# EAGLE design 2023_ROBOCON_B_CHIKU (EAGLE 9.6.2)

## Sheet 1 of 2
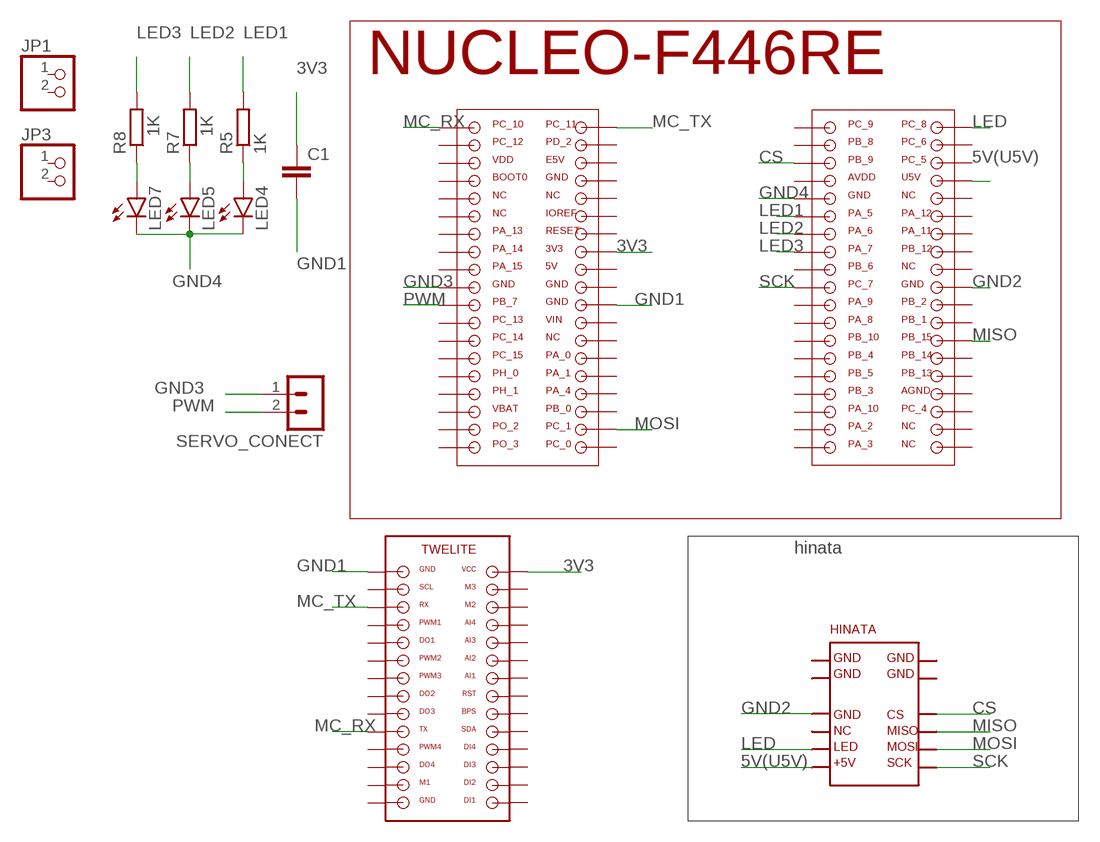
[diagram p0: schematic, sheet 1]

### Parts
C1  C2,5-3  [C2.5-3]
JP1  PINHD-1X2  [1X02]
JP3  PINHD-1X2  [1X02]
LED4  LED3MM  [LED3MM]
LED5  LED3MM  [LED3MM]
LED7  LED3MM  [LED3MM]
R5  1K  R-EU_0204/5  [0204/5]
R7  1K  R-EU_0204/5  [0204/5]
R8  1K  R-EU_0204/5  [0204/5]
SERVO_CONECT  02-JST  [B2B-XH]
U$2  F446RE  [F446RE]
U$5  TWELITE-PIN  [TWELITE-PIN]
U$6  HINATA  [HINATA]

### Nets
3V3: C1.1 U$2.3V3 U$5.VCC
5V(U5V): U$2.USV U$6.+5V
CS: U$2.PB_9 U$6.CS
GND1: C1.2 U$2.GND6 U$5.GND1
GND2: U$2.GND2 U$6.GND5
GND3: SERVO_CONECT.1 U$2.GND3
GND4: LED4.K(C) LED5.K(C) LED7.K(C) U$2.GND
LED: U$2.PC_8 U$6.LED
LED1: R5.2 U$2.PA_5
LED2: R7.2 U$2.PA_6
LED3: R8.2 U$2.PA_7
MC_RX: U$2.PC_10 U$5.TX
MC_TX: U$2.PC_11 U$5.RX
MISO: U$2.PB_15 U$6.MISO
MOSI: U$2.PC_1 U$6.MOSI
N$6: LED4.A R5.1
N$11: LED5.A R7.1
N$14: LED7.A R8.1
PWM: SERVO_CONECT.2 U$2.PB_7
SCK: U$2.PC_7 U$6.SCK
Unconnected: JP1.1 JP1.2 JP3.1 JP3.2 U$2.5V U$2.AGND U$2.AVDD U$2.BOOT0 U$2.ESV U$2.GND4 U$2.GND5 U$2.IOREF U$2.NC U$2.NC2 U$2.NC3 U$2.NC4 U$2.NC5 U$2.NC6 U$2.NC7 U$2.NC8 U$2.PA_0 U$2.PA_1 U$2.PA_2 U$2.PA_3 U$2.PA_4 U$2.PA_8 U$2.PA_9 U$2.PA_10 U$2.PA_11 U$2.PA_12 U$2.PA_13 U$2.PA_14 U$2.PA_15 U$2.PB_0 U$2.PB_1 U$2.PB_2 U$2.PB_3 U$2.PB_4 U$2.PB_5 U$2.PB_6 U$2.PB_8 U$2.PB_10 U$2.PB_12 U$2.PB_13 U$2.PB_14 U$2.PC_0 U$2.PC_2 U$2.PC_3 U$2.PC_4 U$2.PC_5 U$2.PC_6 U$2.PC_9 U$2.PC_12 U$2.PC_13 U$2.PC_14 U$2.PC_15 U$2.PD_2 U$2.PH_0 U$2.PH_1 U$2.RESET U$2.VBAT U$2.VDD U$2.VIN U$5.AI1 U$5.AI2 U$5.AI3 U$5.AI4 U$5.BPS U$5.DI1 U$5.DI2 U$5.DI3 U$5.DI4 U$5.DO1 U$5.DO2 U$5.DO3 U$5.DO4 U$5.GND2 U$5.M1 U$5.M2 U$5.M3 U$5.PWM1 U$5.PWM2 U$5.PWM3 U$5.PWM4 U$5.RST U$5.SCL U$5.SDA U$6.GND1 U$6.GND2 U$6.GND3 U$6.GND4 U$6.NC

### Notes on the sheet
- hinata

## Sheet 2 of 2
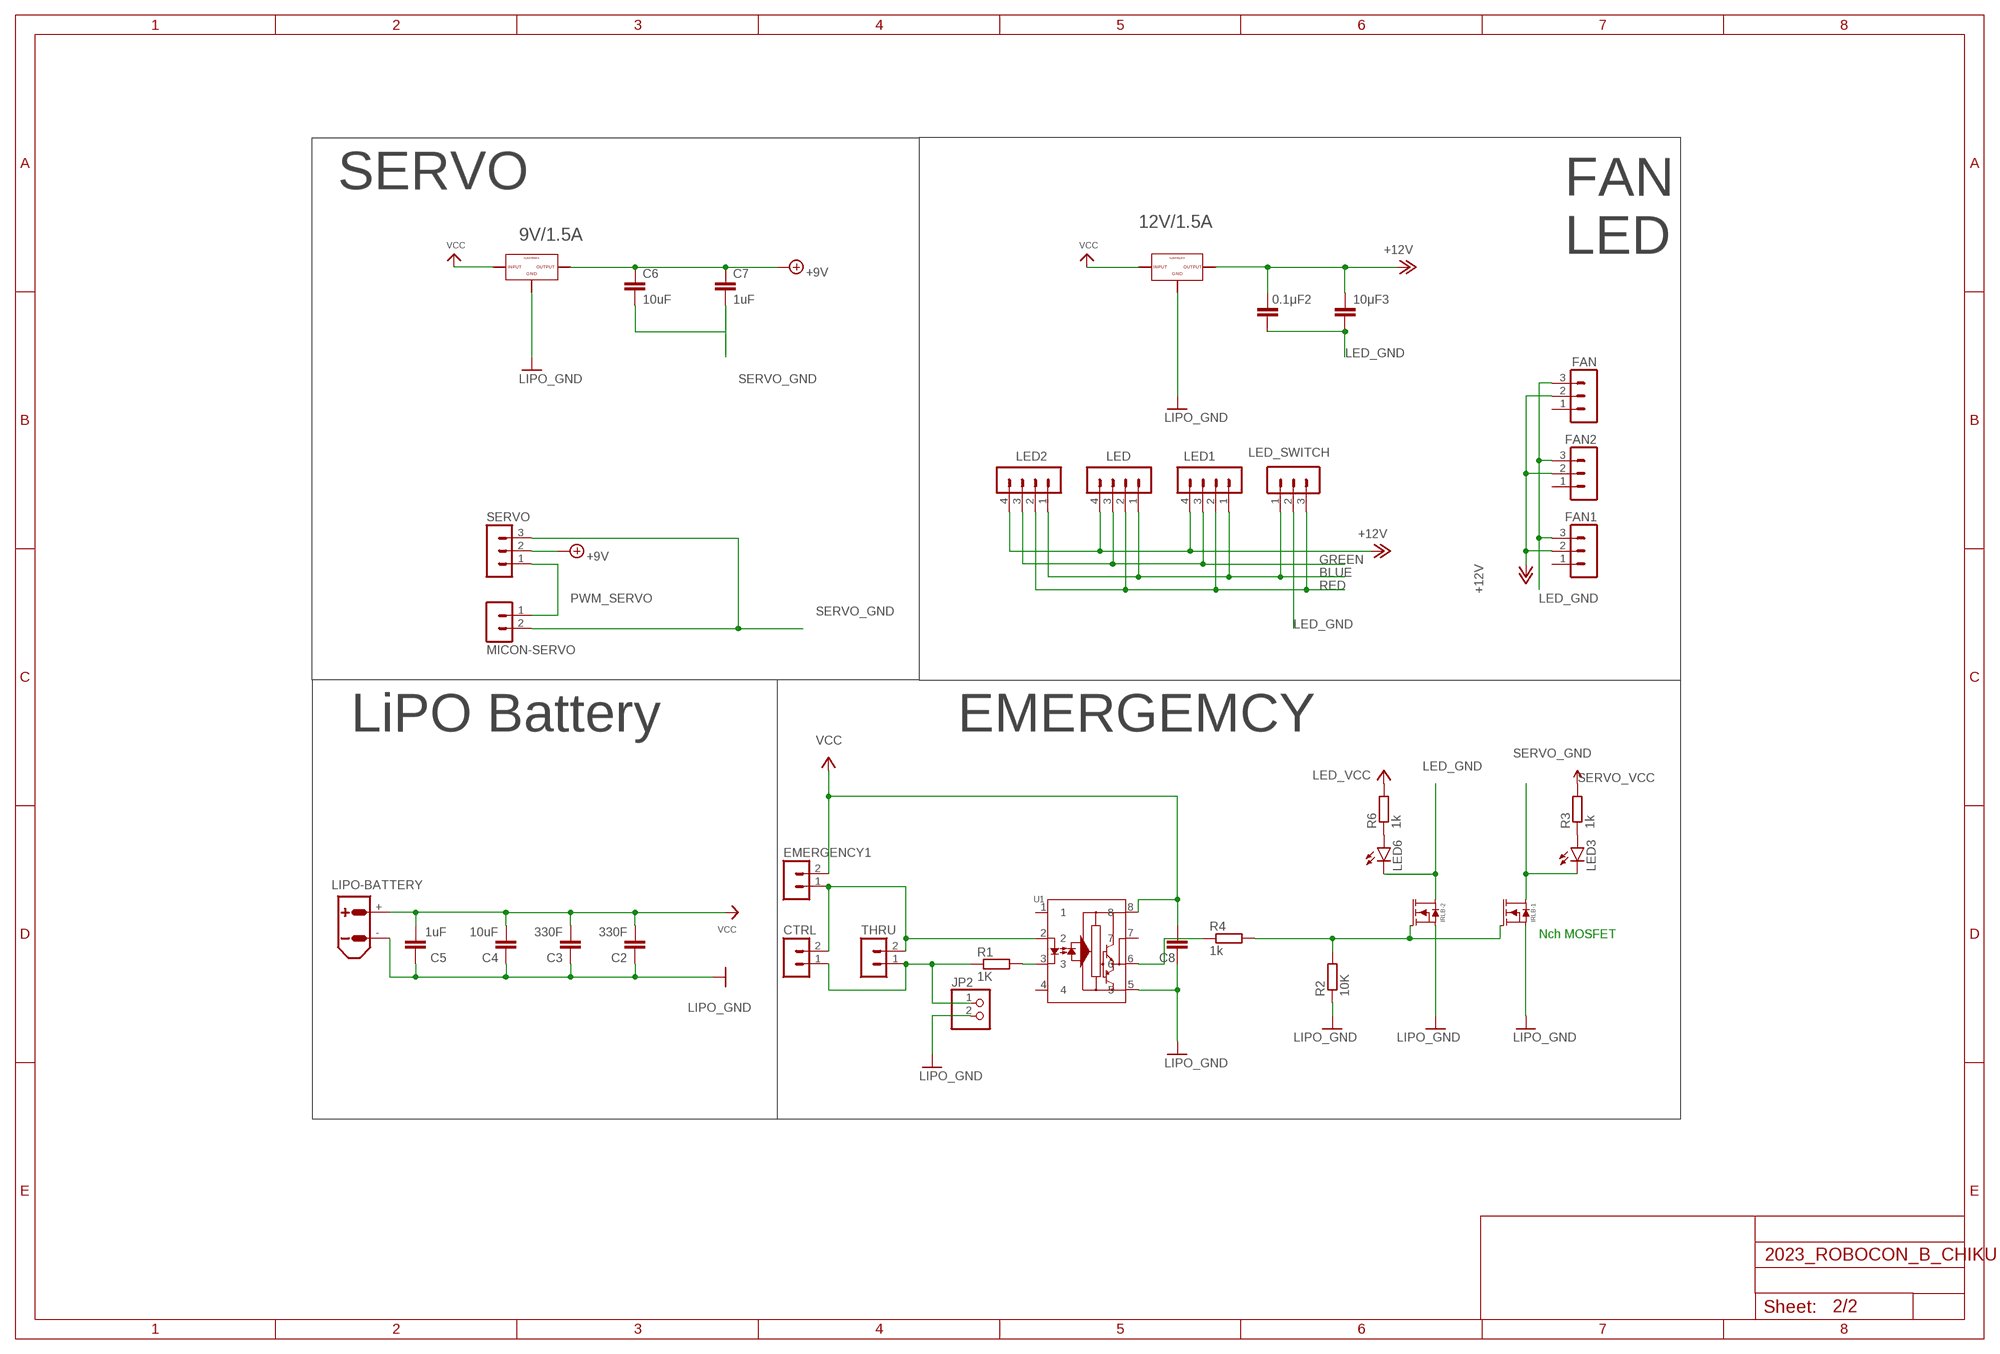
[diagram p1: schematic, sheet 2]

### Parts
0.1μF2  C2,5-3  [C2.5-3]
10μF3  C2,5-3  [C2.5-3]
C2  330F  C2,5-3  [C2.5-3]
C3  330F  C2,5-3  [C2.5-3]
C4  10uF  C2,5-3  [C2.5-3]
C5  1uF  C2,5-3  [C2.5-3]
C6  10uF  C2,5-3  [C2.5-3]
C7  1uF  C2,5-3  [C2.5-3]
C8  C2,5-3  [C2.5-3]
CTRL  02-JST  [B2B-XH]
EMERGENCY1  02-JST  [B2B-XH]
FAN  03-JST  [B3B-XH]
FAN1  03-JST  [B3B-XH]
FAN2  03-JST  [B3B-XH]
IRLB-1  IRLB3813STAND  [TO-220AB-STAND]
IRLB-2  IRLB3813STAND  [TO-220AB-STAND]
JP2  PINHD-1X2  [1X02]
LED  04-JST  [B4B-XH]
LED1  04-JST  [B4B-XH]
LED2  04-JST  [B4B-XH]
LED3  LED5MM  [LED5MM]
LED6  LED5MM  [LED5MM]
LED_SWITCH  03-JST  [B3B-XH]
LIPO-BATTERY  XT90PB-F  [XT90PB-F]
MICON-SERVO  02-JST  [B2B-XH]
R1  1K  R-EU_0204/5  [0204/5]
R2  10K  R-EU_0204/5  [0204/5]
R3  1k  R-EU_0207/12  [0207/12]
R4  1k  R-EU_0207/7  [0207/7]
R6  1k  R-EU_0207/12  [0207/12]
SERVO  03-JST  [B3B-XH]
THRU  02-JST  [B2B-XH]
U1  TLP-250  [DIP8_TLP250_6P4X9P66_TOS]
U$4  NJM7812FA  [NJM7812FA]
U$7  NJM7809FA  [NJM7809FA]

### Nets
+9V: C6.1 C7.1 SERVO.2 U$7.OUTPUT
+12V: 0.1μF2.1 10μF3.1 FAN1.2 FAN2.2 FAN.2 LED1.4 LED2.4 LED.4 U$4.OUTPUT
BLUE: LED1.1 LED2.1 LED.1 LED_SWITCH.1
GND: C2.1 C3.1 C4.1 C5.1 C8.2 IRLB-1.S IRLB-2.S JP2.2 LIPO-BATTERY.- R2.1 U1.5 U$4.GND U$7.GND ; supply symbol labelled LIPO_GND
GREEN: LED1.3 LED2.3 LED.3
LED_GND: 0.1μF2.2 10μF3.2 FAN1.3 FAN2.3 FAN.3 IRLB-2.D LED6.K(C) LED_SWITCH.2
N$1: LED6.A R6.1
N$2: CTRL.1 JP2.1 R1.1 THRU.1
N$3: LED3.A R3.1
N$4: R4.1 U1.6
N$5: R1.2 U1.3
N$7: IRLB-1.G IRLB-2.G R2.2 R4.2
N$10: CTRL.2 EMERGENCY1.1 THRU.2 U1.2
PWM_SERVO: MICON-SERVO.1 SERVO.1
RED: LED1.2 LED2.2 LED.2 LED_SWITCH.3
SERVO_GND: C6.2 C7.2 IRLB-1.D LED3.K(C) MICON-SERVO.2 SERVO.3
VCC: C2.2 C3.2 C4.2 C5.2 C8.1 EMERGENCY1.2 LIPO-BATTERY.+ R3.2 R6.2 U1.8 U$4.INPUT U$7.INPUT ; supply symbol labelled LED_VCC, SERVO_VCC
Unconnected: FAN1.1 FAN2.1 FAN.1 U1.1 U1.4 U1.7

### Notes on the sheet
- SERVO
- 12V/1.5A
- 9V/1.5A
- FAN
  LED
- LiPO Battery | EMERGEMCY
- Nch MOSFET

## Library data of the parts
0.1μF2 10μF3 C1-C8 = capacitor-wima:C: CAPACITOR naming: grid - package width
CTRL EMERGENCY1 SERVO_CONECT THRU = con-jst-xh_1:02-JST: JST CONNECTOR
FAN FAN1 FAN2 LED_SWITCH = con-jst-xh_1:03-JST: JST CONNECTOR
IRLB-1 IRLB-2 = OKUDA_libraries:IRLB3813
JP1-JP3 = pinhead:PINHD-1X2: PIN HEADER
LED LED1 LED2 = con-jst-xh_1:04-JST: JST CONNECTOR
LED3-LED7 = led:LED: LED OSRAM: - CHIPLED LG R971, LG N971, LY N971, LG Q971, LY Q971, LO R971, LY R971 LH N974, LH R974 LS Q976, LO Q976, LY Q976 LO Q996 - Hyper CHIPLED LW Q18S LB Q993, LB Q99A, LB R99A - SideLED LS A670, LO A670, LY A670, LG A670, LP A670 LB A673, LV A673, LT A673, LW A673 LH A674 LY A675 LS A676, LA A676, LO A676, LY A676, LW A676 LS A679, LY A679, LG A679 - Hyper Micro SIDELED® LS Y876, LA Y876, LO Y876, LY Y876 LT Y87S - SmartLED LW L88C, LW L88S LB L89C, LB L89S, LG L890 LS L89K, LO L89K, LY L89K LS L896, LA L896, LO L896, LY L896 - TOPLED LS T670, LO T670, LY T670, LG T670, LP T670 LSG T670, LSP T670, LSY T670, LOP T670, LYG T670 LG T671, LOG T671, LSG T671 LB T673, LV T673, LT T673, LW T673 LH T674 LS T676, LA T676, LO T676, LY T676, LB T676, LH T676, LSB T676, LW T676 LB T67C, LV T67C, LT T67C, LS T67K, LO T67K, LY T67K, LW E67C LS E67B, LA E67B, LO E67B, LY E67B, LB E67C, LV E67C, LT E67C LW T67C LS T679, LY T679, LG T679 LS T770, LO T770, LY T770, LG T770, LP T770 LB T773, LV T773, LT T773, LW T773 LH T774 LS E675, LA E675, LY E675, LS T675 LS T776, LA T776, LO T776, LY T776, LB T776 LHGB T686 LT T68C, LB T68C - Hyper Mini TOPLED® LB M676 - Mini TOPLED Santana® LG M470 LS M47K, LO M47K, LY M47K Source: http://www.osram.convergy.de LUXEON: - LUMILED® LXK2-PW12-R00, LXK2-PW12-S00, LXK2-PW14-U00, LXK2-PW14-V00 LXK2-PM12-R00, LXK2-PM12-S00, LXK2-PM14-U00 LXK2-PE12-Q00, LXK2-PE12-R00, LXK2-PE12-S00, LXK2-PE14-T00, LXK2-PE14-U00 LXK2-PB12-K00, LXK2-PB12-L00, LXK2-PB12-M00, LXK2-PB14-N00, LXK2-PB14-P00, LXK2-PB14-Q00 LXK2-PR12-L00, LXK2-PR12-M00, LXK2-PR14-Q00, LXK2-PR14-R00 LXK2-PD12-Q00, LXK2-PD12-R00, LXK2-PD12-S00 LXK2-PH12-R00, LXK2-PH12-S00 LXK2-PL12-P00, LXK2-PL12-Q00, LXK2-PL12-R00 Source: www.luxeon.com KINGBRIGHT: KA-3528ASYC Source: www.kingbright.com
LIPO-BATTERY = amass:XT90: AMASS XT90 connector Store in Japan AMASS XT90 connector <https://szc.jp/ams-xt90>
MICON-SERVO = con-jst-xh (4):02-JST: JST CONNECTOR
R1-R8 = resistor:R-EU_: RESISTOR, European symbol
SERVO = con-jst-xh (4):03-JST: JST CONNECTOR
U1 = tlp250:TLP-250; COPYRIGHT: Copyright (C) 2023 Ultra Librarian. All rights reserved.; MANUFACTURER_PART_NUMBER: TLP-250; MFR_NAME: Toshiba Electronic Devices & Storage Corp.
U$2 = F446RE_ver1.4:F446RE
U$4 = NJM7812FA:NJM7812FA
U$5 = TWELITE_ver1.2 (1):TWELITE-PIN
U$6 = HINATA:HINATA
U$7 = NJM7809FA:NJM7809FA

## Board
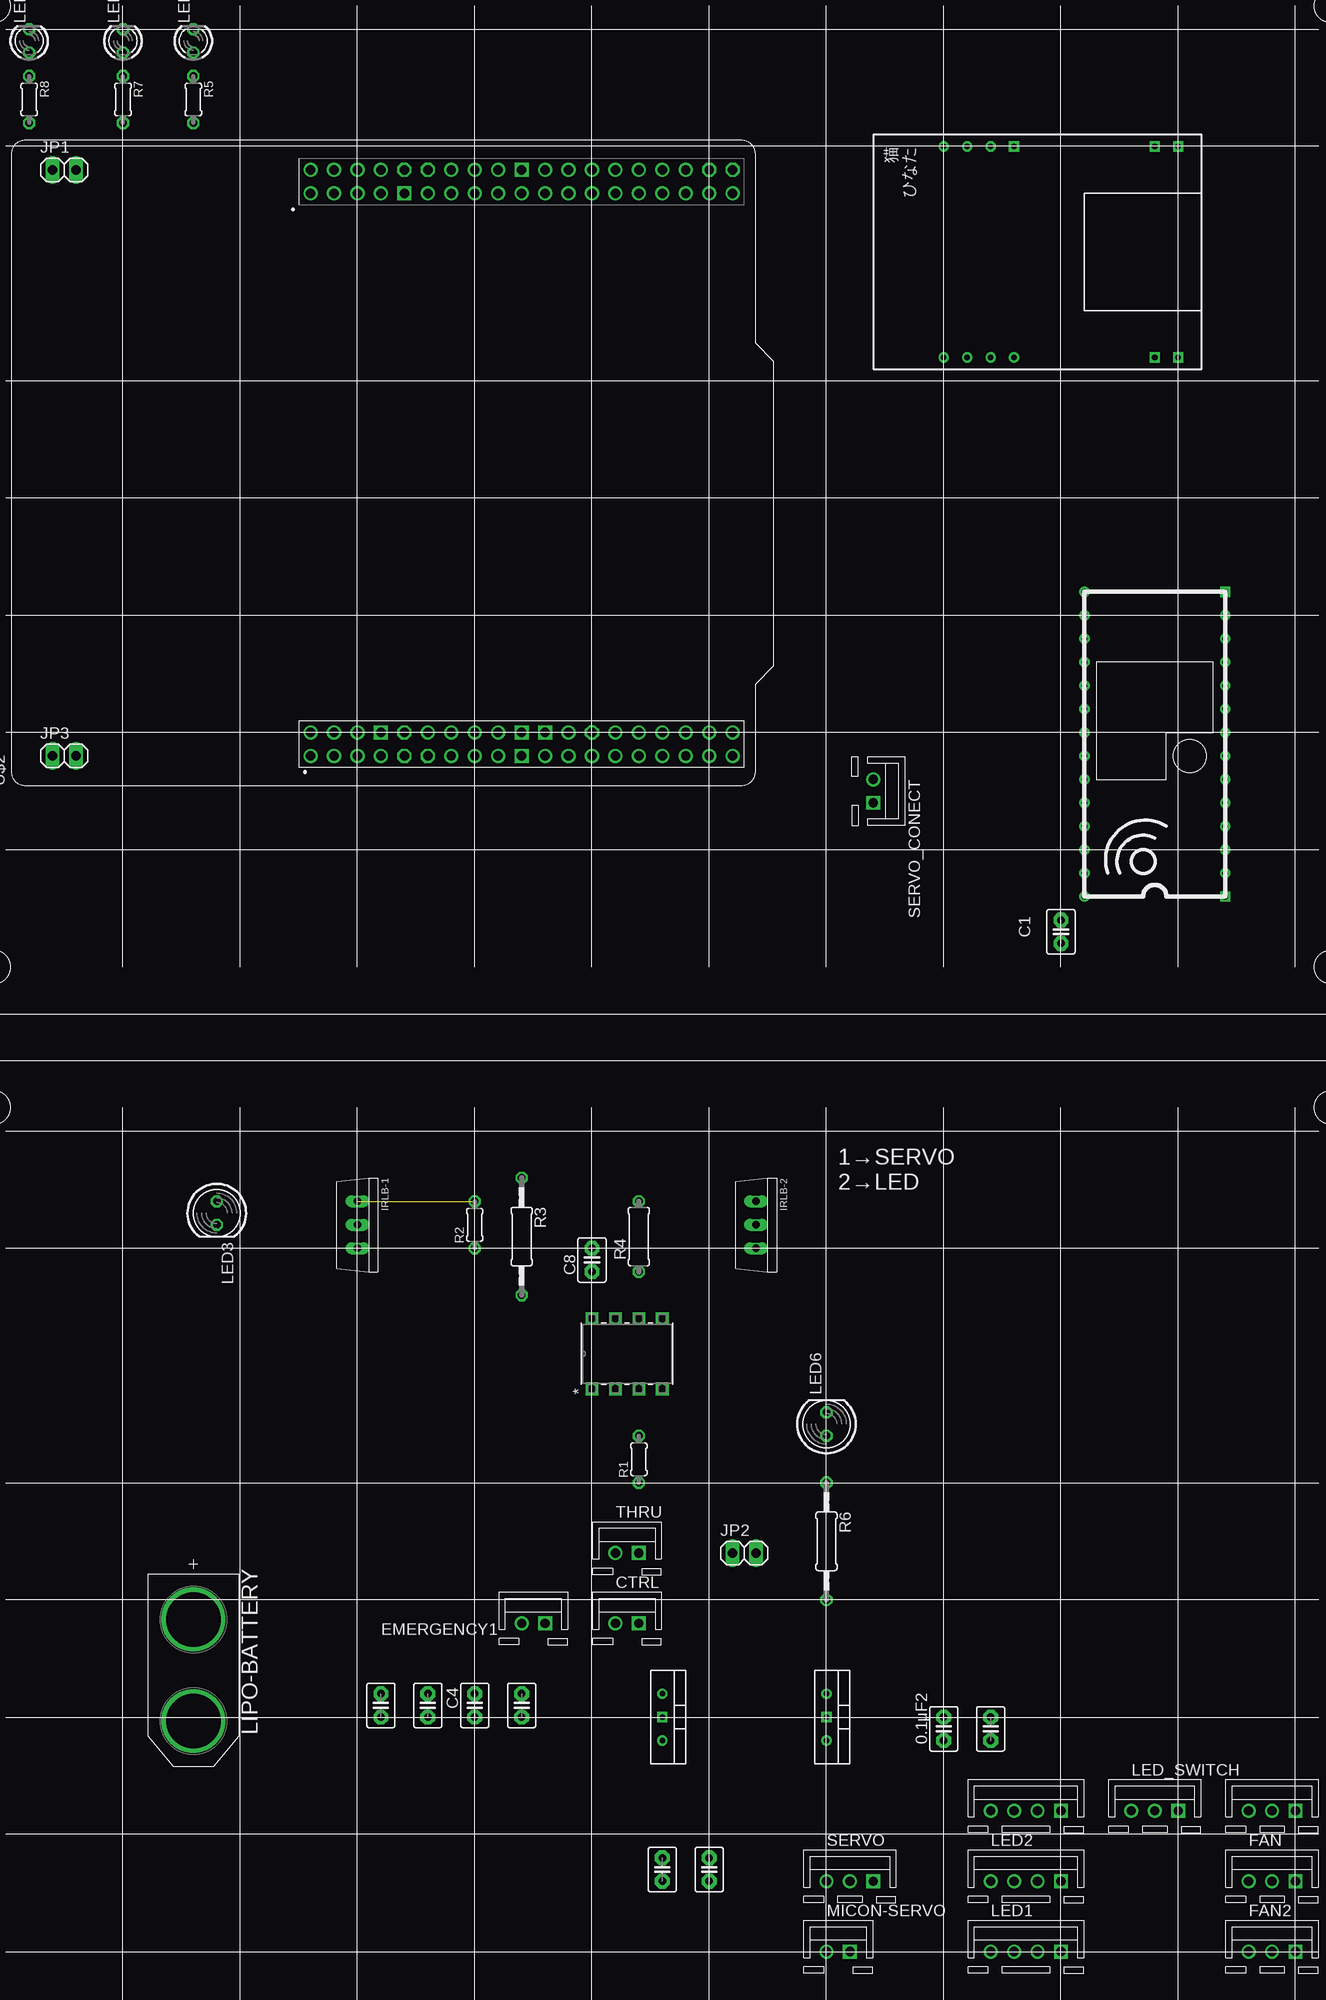
[diagram p2: board, top side]
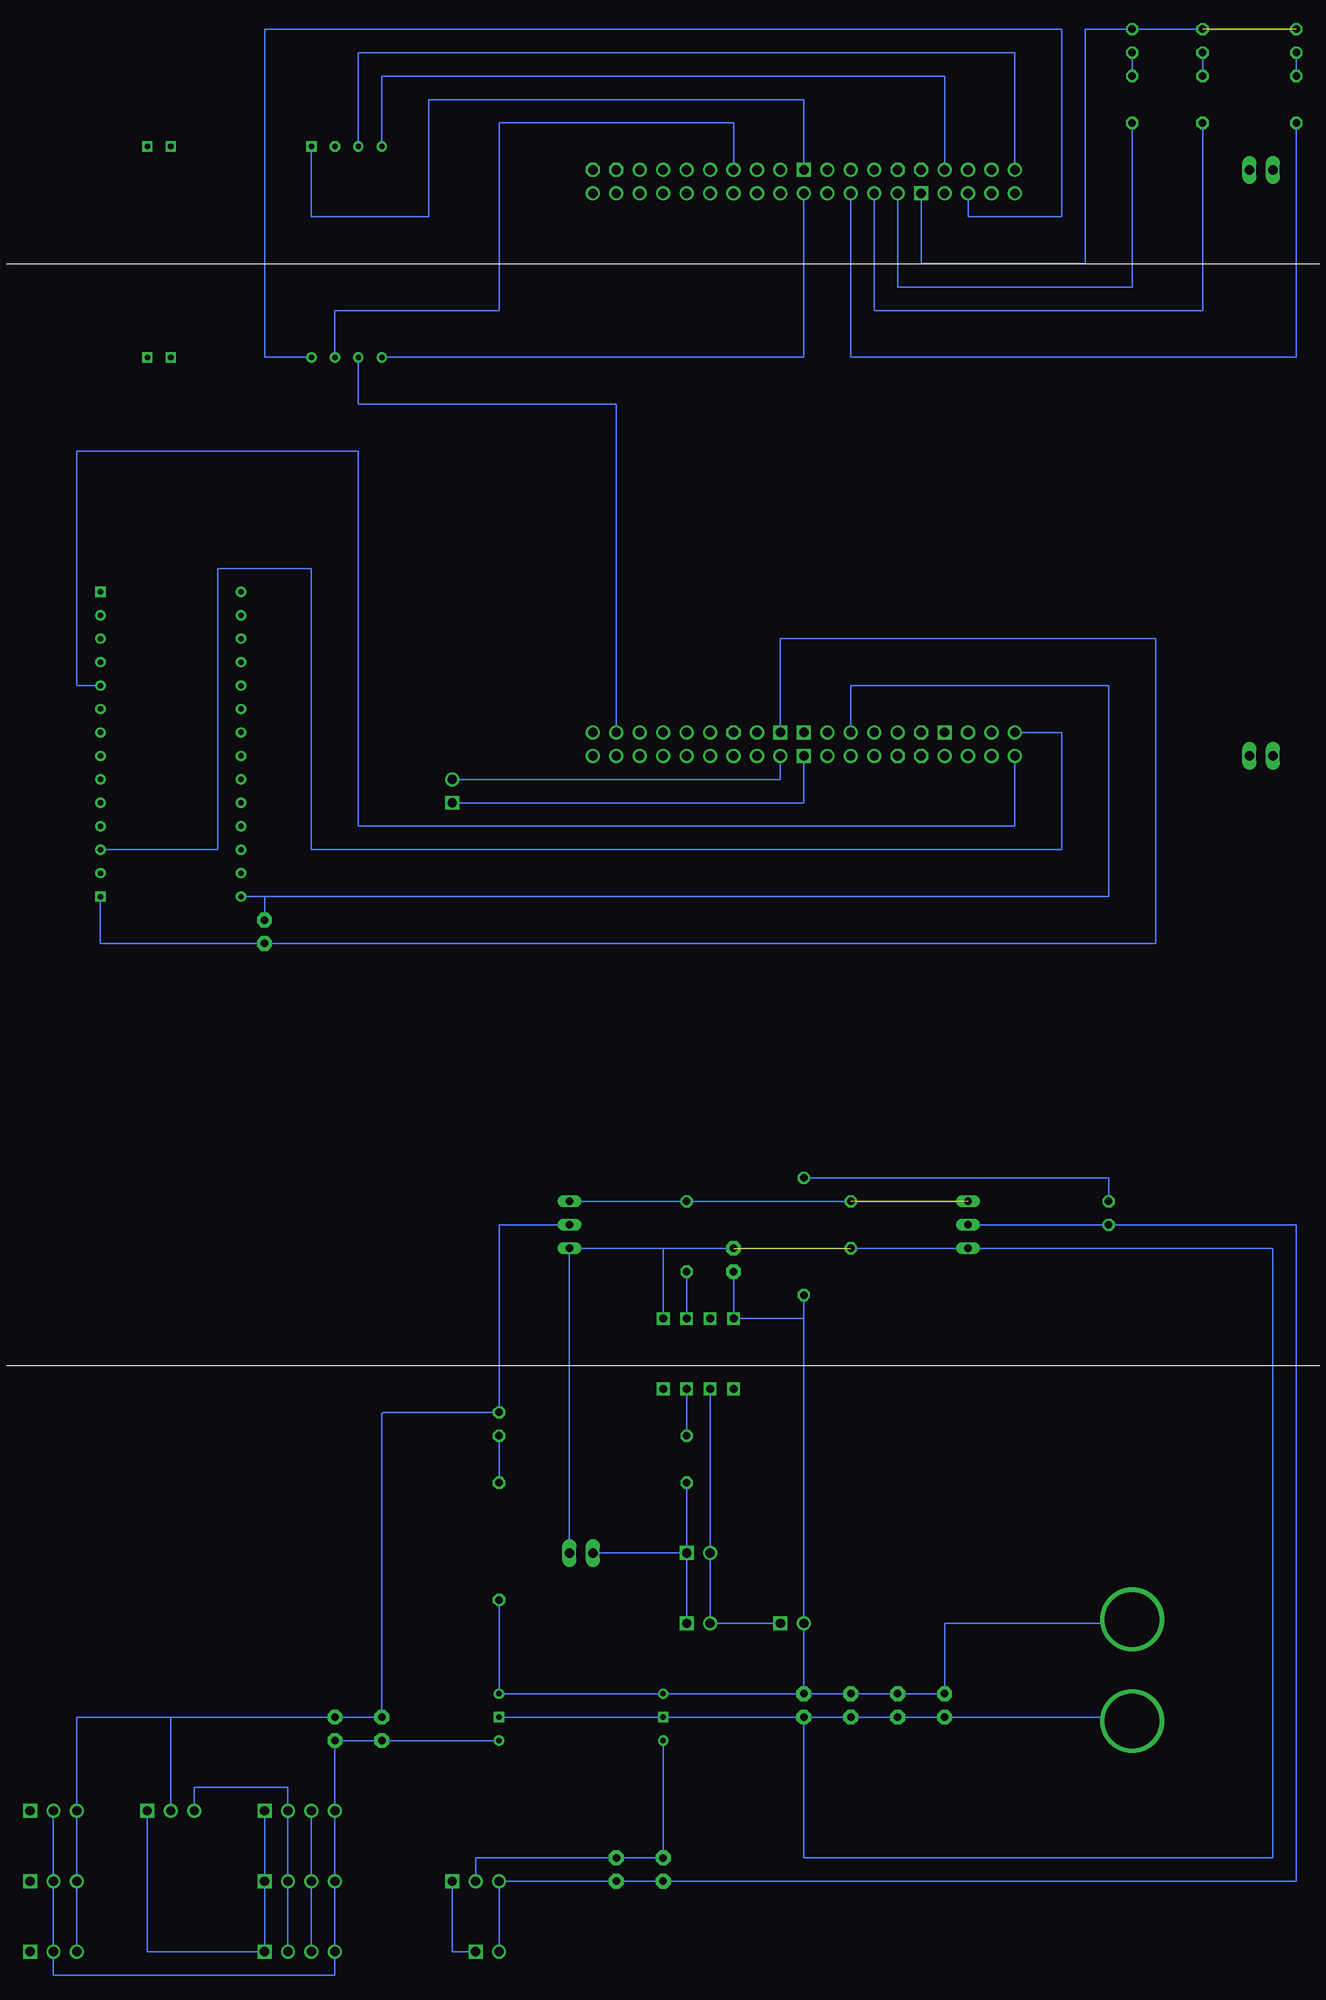
[diagram p3: board, bottom side, seen from below]

No outline drawn. Coordinates in mm, seen from the top.
Copper layers (1*16): Top 0.035mm / dielectric 1.5mm / Bottom 0.035mm
Design rules "default": minimum track width 6mil, minimum drill 0.35mm, track to track 6mil, track to pad 6mil, pad to pad 6mil, via to via 6mil, smd to smd 6mil, copper to edge 40mil, drill to drill 6mil, minimum pad ring 10mil, minimum via ring 8mil, stop-mask expansion 4mil, vias tented up to drill 0mil, thermal gap 10mil

### Footprints (pad centres in the part's own frame; a part is rotated, then mirrored left to right if it is on the bottom)
C2.5-3 = drill 0.813 pad 1.6 octagon: 1 -1.27,0; 2 1.27,0
B2B-XH = drill 1 square: 1 1.27,0 | drill 1: 2 -1.27,0
B3B-XH = drill 1 square: 1 2.54,0 | drill 1: 2 0,0; 3 -2.54,0
TO-220AB-STAND = drill 0.8 long: D 0,0; G -2.54,0; S 2.54,0
1X02 = drill 1.016 long: 1 -1.27,0; 2 1.27,0
B4B-XH = drill 1 square: 1 3.81,0 | drill 1: 2 1.27,0; 3 -1.27,0; 4 -3.81,0
LED5MM = drill 0.813 octagon: A -1.27,0; K 1.27,0
LED3MM = drill 0.813 octagon: A -1.27,0; K 1.27,0
XT90PB-F = drill 5.9: + 5.5,0; - -5.5,0
0204/5 = drill 0.813 octagon: 1 -2.54,0; 2 2.54,0
0207/12 = drill 0.813 octagon: 1 -6.35,0; 2 6.35,0
0207/7 = drill 0.813 octagon: 1 -3.81,0; 2 3.81,0
DIP8_TLP250_6P4X9P66_TOS = drill 0.864 pad 1.372 square: 1 0,0; 2 0,-2.54; 3 0,-5.08; 4 0,-7.62; 5 7.62,-7.62; 6 7.62,-5.08; 7 7.62,-2.54; 8 7.62,0
F446RE = drill 1.02: 3V3 6.35,30.48; 5V 6.35,27.94; AGND 67.31,10.16; AVDD 64.77,40.64; BOOT0 3.81,40.64; ESV 6.35,43.18; IOREF 6.35,35.56; PA_0 6.35,15.24; PA_1 6.35,12.7; PA_2 64.77,5.08; PA_3 64.77,2.54; PA_4 6.35,10.16; PA_5 64.77,35.56; PA_6 64.77,33.02; PA_7 64.77,30.48; PA_8 64.77,20.32; PA_9 64.77,22.86; PA_10 64.77,7.62; PA_11 67.31,30.48; PA_12 67.31,33.02; PA_13 3.81,33.02; PA_14 3.81,30.48; PA_15 3.81,27.94; PB_0 6.35,7.62; PB_1 67.31,20.32; PB_2 67.31,22.86; PB_3 64.77,10.16; PB_4 64.77,15.24; PB_5 64.77,12.7; PB_6 64.77,27.94; PB_7 3.81,22.86; PB_8 64.77,45.72; PB_9 64.77,43.18; PB_10 64.77,17.78; PB_12 67.31,27.94; PB_13 67.31,12.7; PB_14 67.31,15.24; PB_15 67.31,17.78; PC_0 6.35,2.54; PC_1 6.35,5.08; PC_2 3.81,5.08; PC_3 3.81,2.54; PC_4 67.31,7.62; PC_5 67.31,43.18; PC_6 67.31,45.72; PC_7 64.77,25.4; PC_8 67.31,48.26; PC_9 64.77,48.26; PC_10 3.81,48.26; PC_11 6.35,48.26; PC_12 3.81,45.72; PC_13 3.81,20.32; PC_14 3.81,17.78; PC_15 3.81,15.24; PD_2 6.35,45.72; PH_0 3.81,12.7; PH_1 3.81,10.16; RESET 6.35,33.02; USV 67.31,40.64; VBAT 3.81,7.62; VDD 3.81,43.18; VIN 6.35,20.32 | drill 1.02 square: GND 64.77,38.1; GND2 67.31,25.4; GND3 3.81,25.4; GND4 6.35,40.64; GND5 6.35,25.4; GND6 6.35,22.86 | drill 1.02 octagon: NC 67.31,38.1; NC2 67.31,35.56; NC3 67.31,5.08; NC4 67.31,2.54; NC5 3.81,38.1; NC6 3.81,35.56; NC7 6.35,38.1; NC8 6.35,17.78
NJM7812FA = drill 0.6 square: GND 0,0 | drill 0.6: INPUT -2.54,0; OUTPUT 2.54,0
TWELITE-PIN = drill 0.6: AI1 15.24,17.78; AI2 15.24,20.32; AI3 15.24,22.86; AI4 15.24,25.4; BPS 15.24,12.7; DI1 15.24,0; DI2 15.24,2.54; DI3 15.24,5.08; DI4 15.24,7.62; DO1 0,22.86; DO2 0,15.24; DO3 0,12.7; DO4 0,5.08; M1 0,2.54; M2 15.24,27.94; M3 15.24,30.48; PWM1 0,25.4; PWM2 0,20.32; PWM3 0,17.78; PWM4 0,7.62; RST 15.24,15.24; RX 0,27.94; SCL 0,30.48; SDA 15.24,10.16; TX 0,10.16; VCC 15.24,33.02 | drill 0.6 square: GND1 0,33.02; GND2 0,0
HINATA = drill 0.6: +5V 1.27,7.62; CS 24.13,15.24; LED 1.27,10.16; MISO 24.13,12.7; MOSI 24.13,10.16; SCK 24.13,7.62 | drill 0.6 square: GND1 1.27,33.02; GND2 1.27,30.48; GND3 24.13,33.02; GND4 24.13,30.48; GND5 1.27,15.24 | drill 0.6 octagon: NC 1.27,12.7
NJM7809FA = drill 0.6 square: GND 0,0 | drill 0.6: INPUT -2.54,0; OUTPUT 2.54,0

### Placement (x,y rotation side)
0.1μF2  92.71,-83.82 90 top
10μF3  97.79,-83.82 90 top
C1  105.41,2.54 270 top
C2  31.75,-81.28 90 top
C3  46.99,-81.28 90 top
C4  41.91,-81.28 90 top
C5  36.83,-81.28 90 top
C6  62.23,-99.06 270 top
C7  67.31,-99.06 270 top
C8  54.61,-33.02 90 top
CTRL  58.42,-72.39 0 top
EMERGENCY1  48.26,-72.39 0 top
FAN  128.27,-100.33 0 top
FAN1  128.27,-92.71 0 top
FAN2  128.27,-107.95 0 top
IRLB-1  29.21,-29.21 270 top
IRLB-2  72.39,-29.21 270 top
JP1  -2.54,85.09 0 top
JP2  71.12,-64.77 0 top
JP3  -2.54,21.59 0 top
LED  101.6,-92.71 0 top
LED1  101.6,-107.95 0 top
LED2  101.6,-100.33 0 top
LED3  13.97,-27.94 270 top
LED4  11.43,99.06 90 top
LED5  3.81,99.06 90 top
LED6  80.01,-50.8 90 top
LED7  -6.35,99.06 90 top
LED_SWITCH  115.57,-92.71 0 top
LIPO-BATTERY  11.43,-77.47 90 top
MICON-SERVO  81.28,-107.95 0 top
R1  59.69,-54.61 90 top
R2  41.91,-29.21 90 top
R3  46.99,-30.48 270 top
R4  59.69,-30.48 90 top
R5  11.43,92.71 270 top
R6  80.01,-63.5 270 top
R7  3.81,92.71 270 top
R8  -6.35,92.71 270 top
SERVO  82.55,-100.33 0 top
SERVO_CONECT  85.09,17.78 270 top
THRU  58.42,-64.77 0 top
U1  54.61,-46.99 90 top
U$1  [TYPE.A]  -16.51,-125.73 0 top
U$2  72.39,17.78 90 top
U$3  [TYPE.A]  -16.51,-6.35 0 top
U$4  80.01,-82.55 270 top
U$5  123.19,39.37 180 top
U$6  85.09,88.9 270 top
U$7  62.23,-82.55 270 top

### Tracks (layer width: path | path; a pad name or v marks a point on that pad's centre or on a via)
3V3
  Bottom 0.152: C1.1 105.41,6.35 | 105.41,6.35 13.97,6.35 13.97,29.21 41.91,29.21 U$2.3V3 | U$5.VCC 105.41,6.35
5V(U5V)
  Bottom 0.152: U$2.USV 31.75,95.25 92.71,95.25 U$6.+5V
+9V
  Bottom 0.152: SERVO.2 82.55,-97.79 C7.1 C6.1 U$7.OUTPUT
+12V
  Bottom 0.152: 10μF3.1 0.1μF2.1 U$4.OUTPUT | 10μF3.1 97.79,-86.36 | FAN1.2 FAN.2 FAN2.2 128.27,-110.49 97.79,-110.49 LED1.4 LED2.4 LED.4 10μF3.1
BLUE
  Bottom 0.152: LED.1 LED2.1 LED1.1 118.11,-107.95 LED_SWITCH.1
CS
  Bottom 0.152: U$2.PB_9 29.21,80.01 19.05,80.01 19.05,100.33 105.41,100.33 105.41,64.77 U$6.CS
GND  (1 unrouted)
  Bottom 0.152: C3.1 C4.1 C5.1 C2.1 11.43,-82.55 LIPO-BATTERY.- | C3.1 45.66,-82.55 | U$7.GND 67.31,-82.55 | U$7.GND U$4.GND | U$7.GND C3.1 | C8.2 -3.81,-31.75 -3.81,-97.79 46.99,-97.79 C3.1 | 62.23,-31.75 IRLB-2.S JP2.2 | C8.2 IRLB-1.S | U1.5 62.23,-31.75 | C8.2 62.23,-31.75
GND1
  Bottom 0.152: U$2.GND6 49.53,34.29 8.89,34.29 8.89,1.27 C1.2 123.19,1.27 U$5.GND1
GND2
  Bottom 0.152: U$2.GND2 46.99,92.71 87.63,92.71 87.63,80.01 100.33,80.01 U$6.GND5
GND3
  Bottom 0.152: U$2.GND3 46.99,16.51 SERVO_CONECT.1
GND4  (1 unrouted)
  Bottom 0.152: LED7.K LED5.K LED4.K 16.51,100.33 16.51,74.93 34.29,74.93 U$2.GND
GREEN
  Bottom 0.152: LED.3 LED2.3 LED1.3
LED
  Bottom 0.152: U$2.PC_8 24.13,97.79 95.25,97.79 U$6.LED
LED1
  Bottom 0.152: R5.2 11.43,72.39 36.83,72.39 U$2.PA_5
LED2
  Bottom 0.152: U$2.PA_6 39.37,69.85 3.81,69.85 R7.2
LED3
  Bottom 0.152: U$2.PA_7 41.91,64.77 -6.35,64.77 R8.2
LED_GND
  Bottom 0.152: 10μF3.2 0.1μF2.2 92.71,-52.07 | 99.06,-82.55 10μF3.2 | FAN2.3 FAN.3 FAN1.3 125.73,-82.55 115.57,-82.55 | 10μF3.2 115.57,-82.55 | LED_SWITCH.2 115.57,-82.55 | 92.71,-50.94 92.71,-52.07 | 74.93,-29.21 IRLB-2.D 80.01,-29.21 LED6.K 92.56,-49.53 92.69,-49.67 92.69,-52.05 92.71,-52.07
MC_RX
  Bottom 0.152: U$2.PC_10 24.13,13.97 95.25,13.97 95.25,54.61 125.73,54.61 125.73,29.21 U$5.TX
MC_TX
  Bottom 0.152: U$2.PC_11 19.05,24.13 19.05,11.43 100.33,11.43 100.33,41.91 110.49,41.91 110.49,11.43 U$5.RX
MISO
  Bottom 0.152: U$2.PB_15 54.61,90.17 80.01,90.17 80.01,69.85 97.79,69.85 U$6.MISO
MOSI
  Bottom 0.152: U$2.PC_1 67.31,59.69 95.25,59.69 U$6.MOSI
N$1
  Bottom 0.152: R6.1 LED6.A
N$2
  Bottom 0.152: THRU.1 CTRL.1 | THRU.1 JP2.1 | R1.1 THRU.1
N$3
  Bottom 0.152: R3.1 13.97,-24.13 LED3.A
N$4
  Bottom 0.152: R4.1 U1.6
N$5
  Bottom 0.152: U1.3 R1.2
N$6
  Bottom 0.152: R5.1 LED4.A
N$7  (1 unrouted)
  Bottom 0.152: IRLB-2.G IRLB-1.G R4.2
N$10
  Bottom 0.152: EMERGENCY1.1 CTRL.2 THRU.2 U1.2
N$11
  Bottom 0.152: R7.1 LED5.A
N$14
  Bottom 0.152: R8.1 LED7.A
PWM
  Bottom 0.152: SERVO_CONECT.2 49.53,19.05 U$2.PB_7
PWM_SERVO
  Bottom 0.152: SERVO.1 85.09,-107.95 MICON-SERVO.1
RED
  Bottom 0.152: LED1.2 LED2.2 LED.2 102.87,-90.17 113.03,-90.17 LED_SWITCH.3
SCK
  Bottom 0.152: U$2.PC_7 46.99,64.77 U$6.SCK
SERVO_GND
  Bottom 0.152: MICON-SERVO.2 SERVO.3 C7.2 C6.2 -6.35,-100.33 -6.35,-29.21 LED3.K IRLB-1.D
VCC
  Bottom 0.152: C3.2 C4.2 C5.2 C2.2 31.75,-72.39 11.43,-72.39 LIPO-BATTERY.+ | C3.2 U$7.INPUT U$4.INPUT R6.2 | C3.2 EMERGENCY1.2 46.99,-39.37 | 46.99,-39.37 U1.8 C8.1 | R3.2 46.99,-39.37

### Text on the board
tNames: 1→SERVO / 2→LED